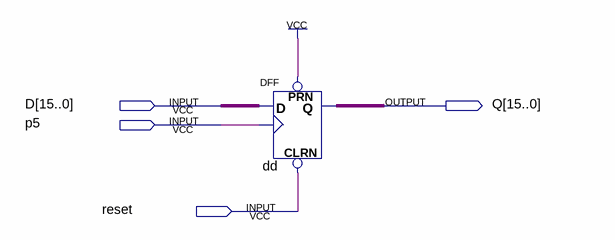
[diagram p0: schematic sheet]
// Quartus schematic pc2.bdf as structural Verilog: 1 symbols, 4 pins
module pc2 (
  input  [15:0] D,
  input  p5,
  input  reset,
  output [15:0] Q
);

  DFF dd[15:0] (.CLRN(reset), .CLK(p5), .D(D), .PRN(1'b1), .Q(Q));
endmodule
